# EasyEDA Pro project ProPrj_两相交错电源demo_2025-05-26.epro, board PCB10
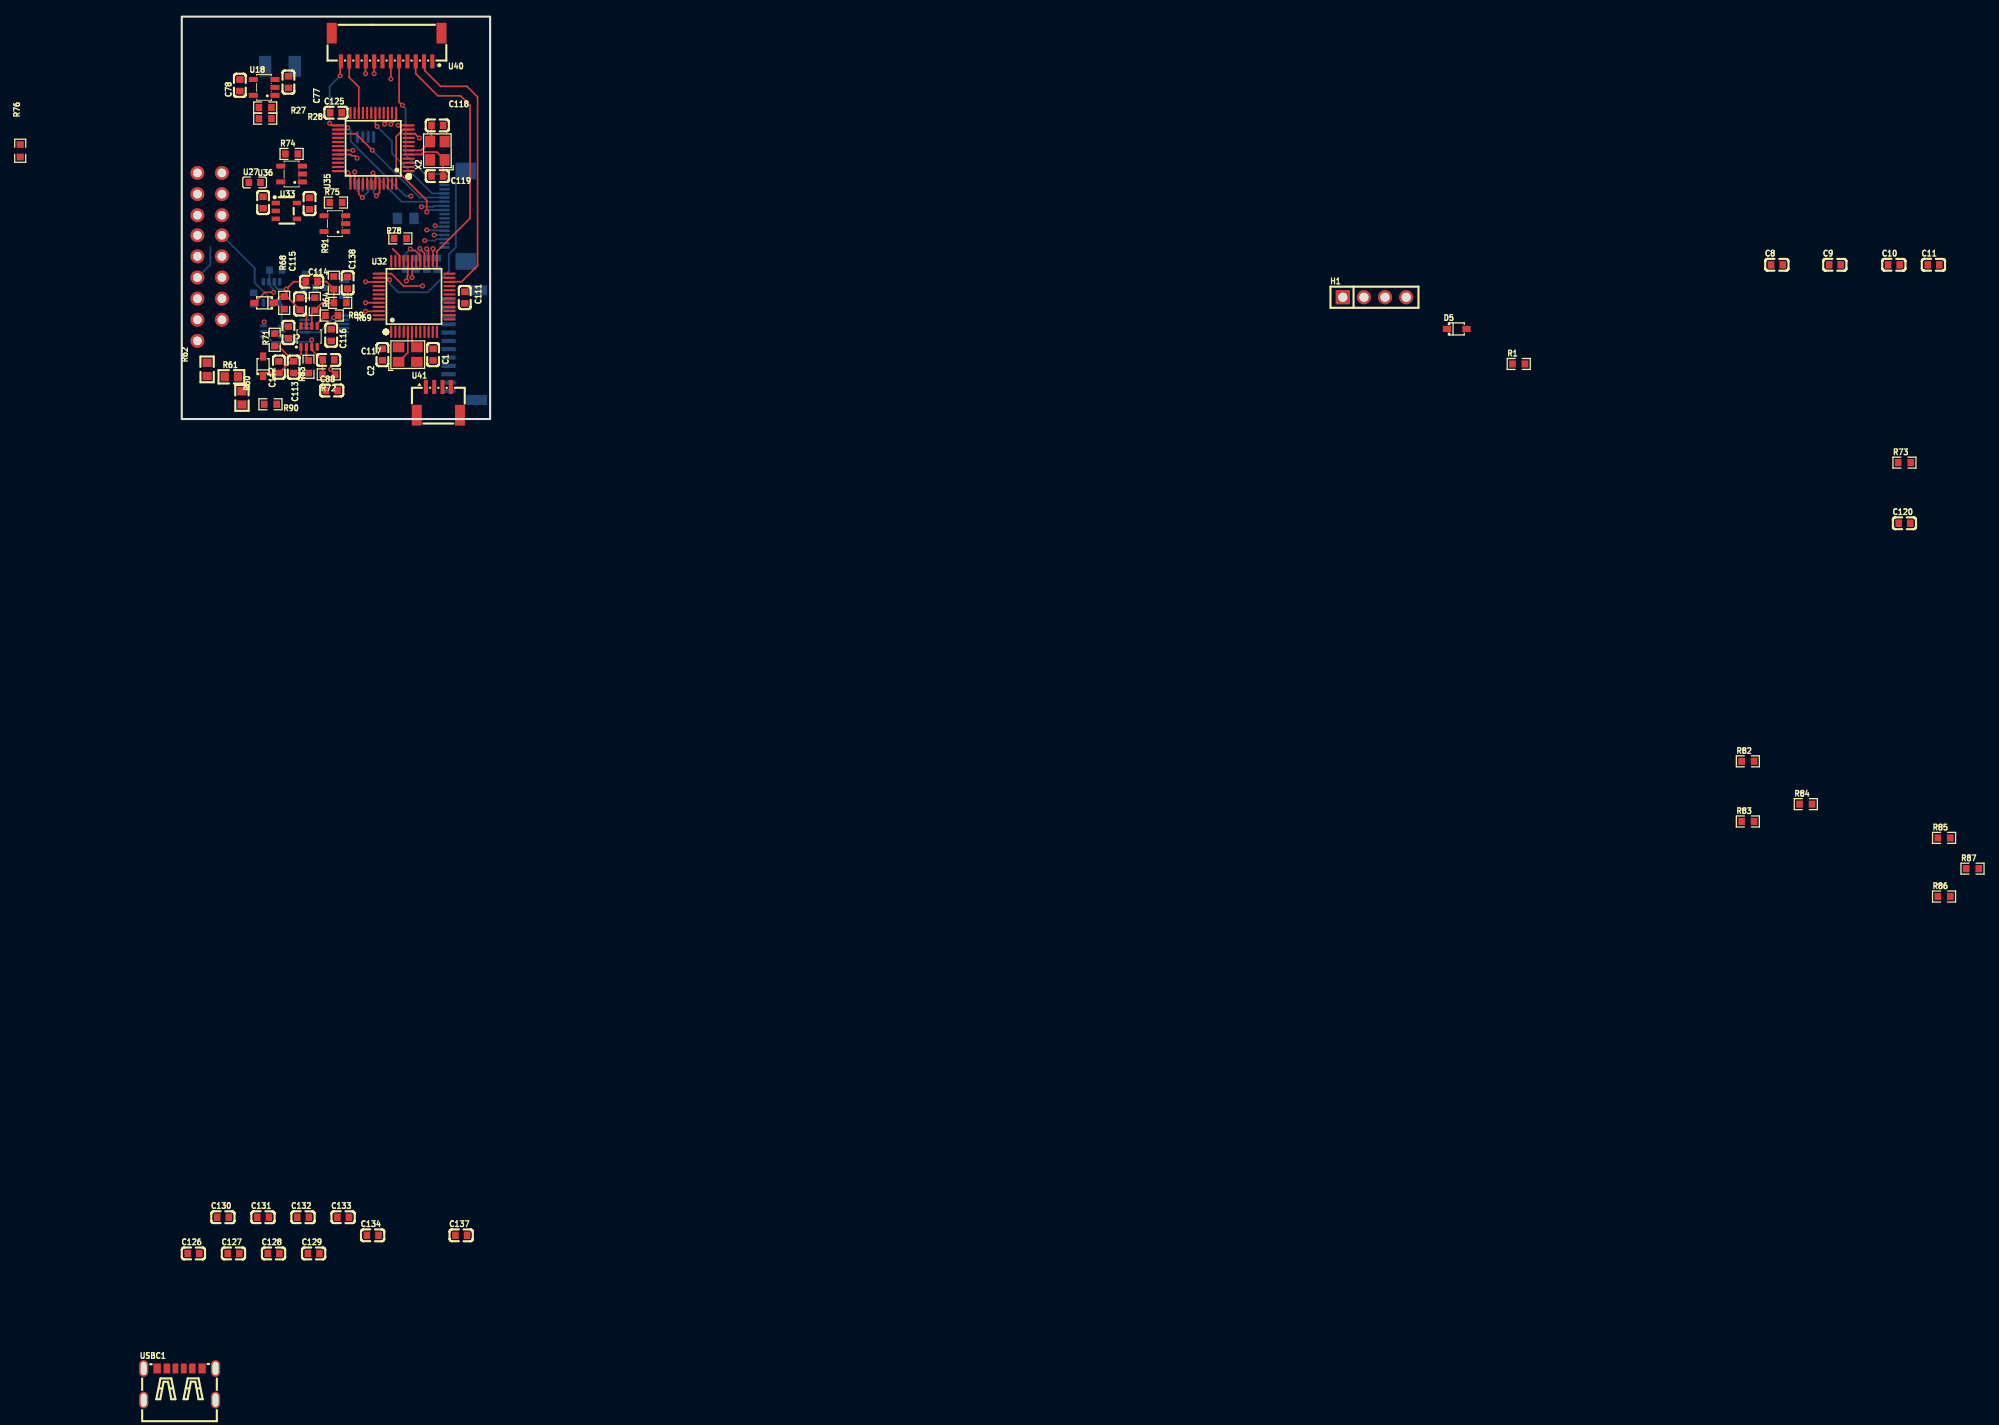
[diagram p13: board, top side]
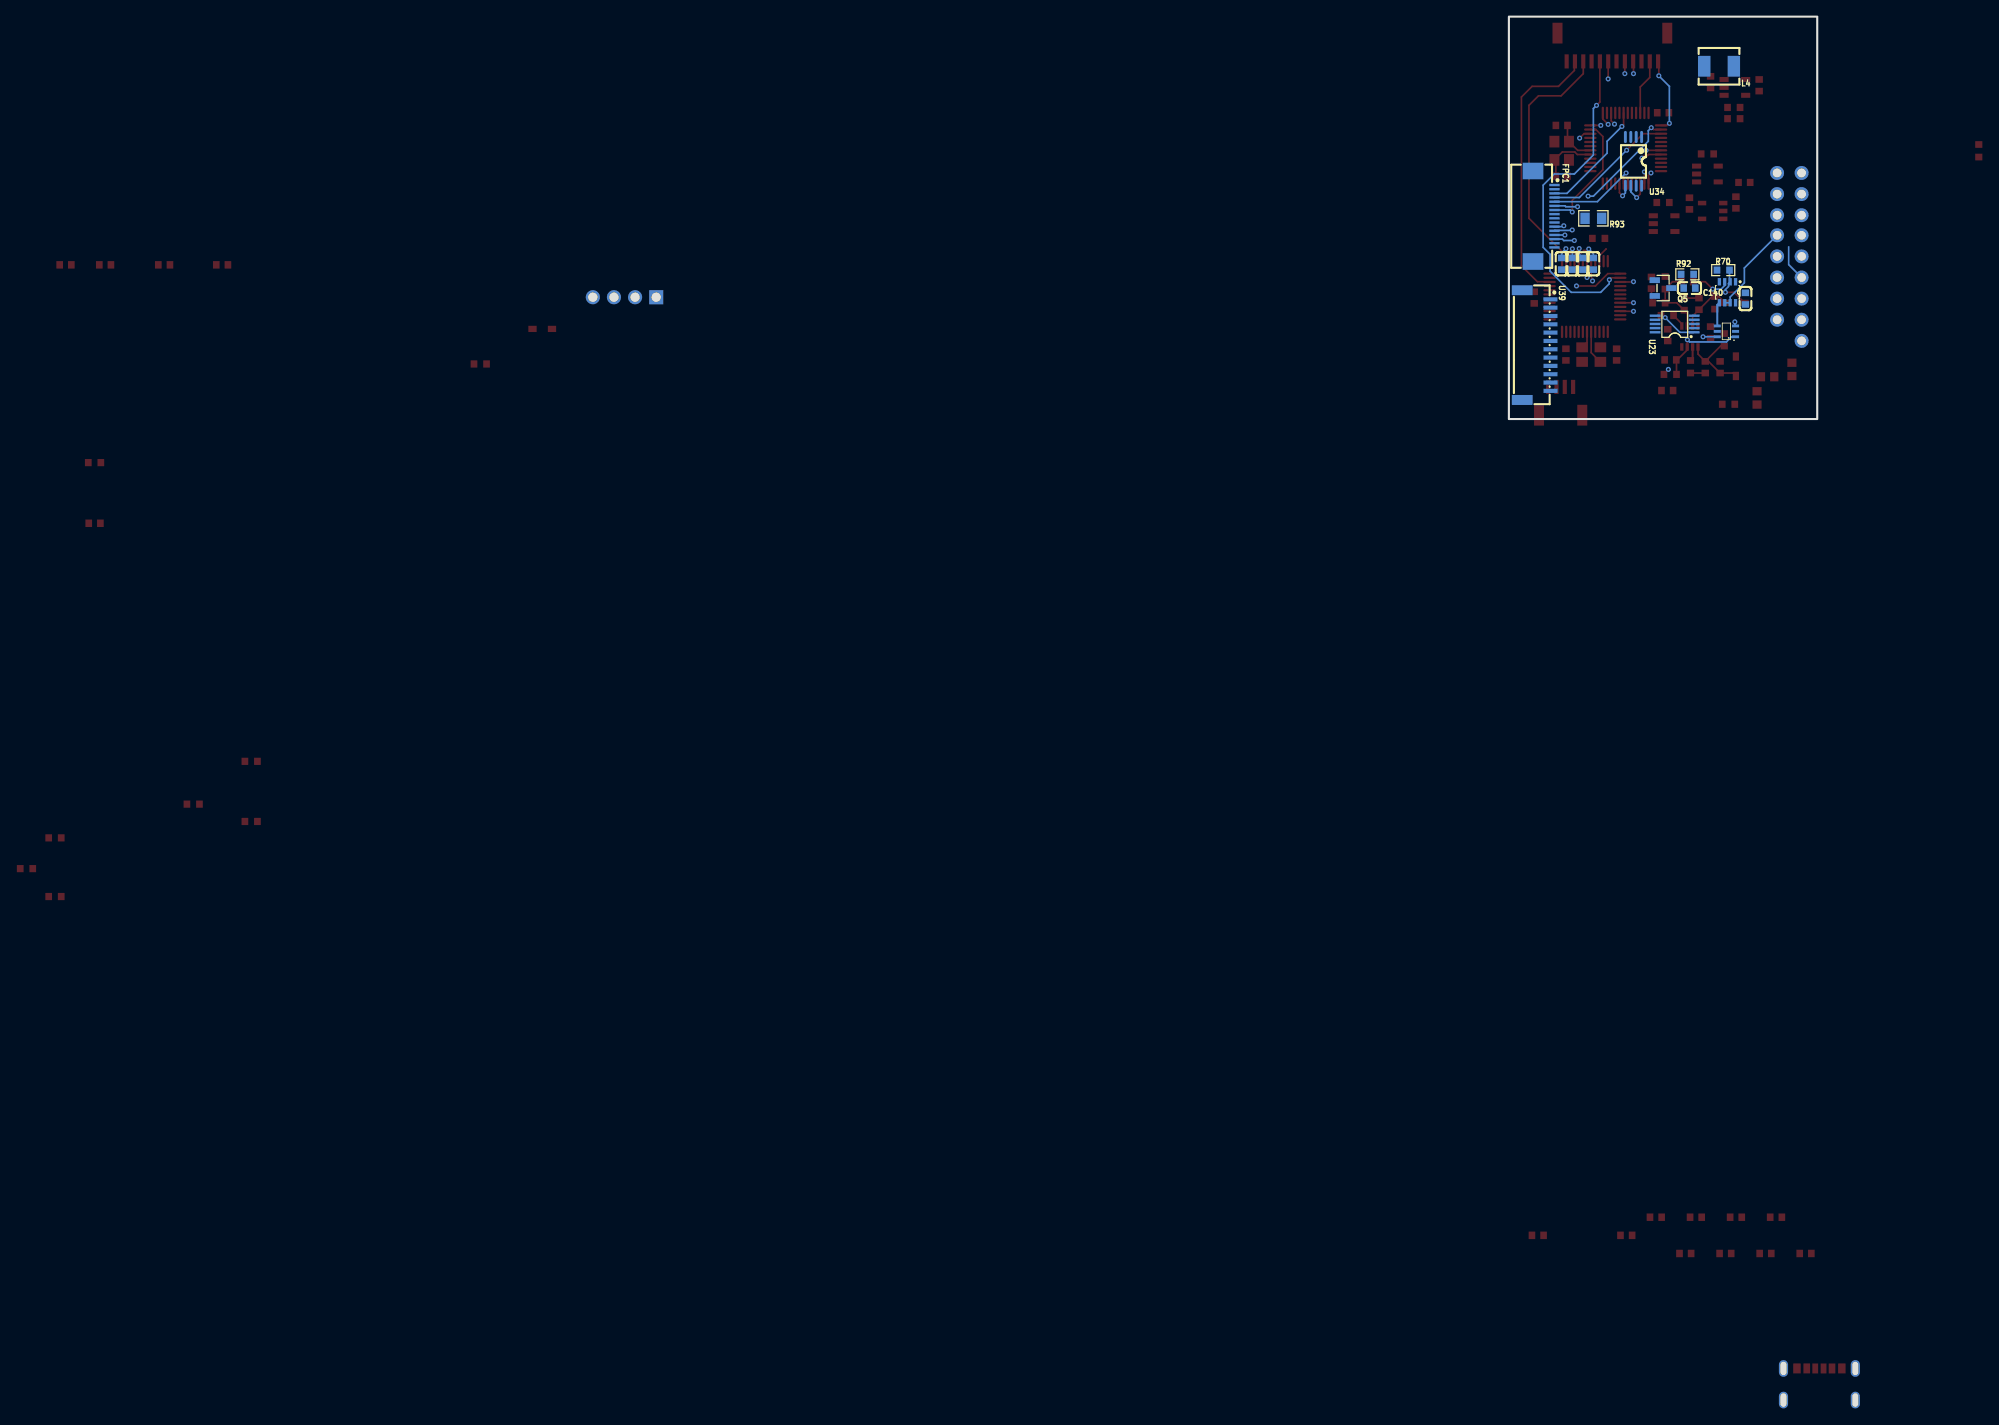
[diagram p14: board, bottom side, seen from below]

Outline 37.08 x 48.39 mm; copper layers: Top Layer, Inner1, Inner2, Bottom Layer. Coordinates in mm from the lower left corner of the outline.
Outline path: rectangle 0,48.39 37.08,0
Stack: Top Layer 0.035mm 外层铜厚1oz / Dielectric1 0.2104mm 7628 RC49% 8.6mil / Inner1 0.0152mm 内层铜厚 / Dielectric2 1.065mm 1.1mm H/HOZ Copper / Inner2 0.0152mm 内层铜厚 / Dielectric3 0.2104mm 7628 RC49% 8.6mil / Bottom Layer 0.035mm 外层铜厚1oz

## Design rules (mm)
template: 自定义配置
spacing copperThickness1oz (default): track to track 0.102, other pairs 0.152 to 0.3
spacing copperThickness2oz: track to track 0.203, other pairs 0.152 to 0.3
track width copperThickness1oz (default): min 0.127, default 0.254, max 2.54
track width copperThickness2oz: min 0.203, default 0.254, max 2.54
differential pair differentialPair (default): width min 0.127, default 0.254, max 2.54; gap min 0.152, default 0.152
via viaSize (default): diameter min 0.5, default 0.61, max 10; hole min 0.3, default 0.305, max 6.3

## Placement (name value [footprint] x y rotation side)
C1  22pF  [C0603#2]  30.23 7.75 90 top
C2  22pF  [C0603#2]  24.13 7.75 90 top
C8  1uF  [C0603#2]  191.85 18.54 0 top
C9  1uF  [C0603#2]  198.82 18.54 0 top
C10  1uF  [C0603#2]  205.92 18.54 0 top
C11  1uF  [C0603#2]  210.69 18.54 0 top
C77  10uF  [C0603#2]  12.83 40.51 90 top
C78  10uF  [C0603#2]  6.99 40.13 90 top
C88  1uF  [C0603#2]  18.03 3.43 0 top
C109  10uF  [C0603#2]  9.78 26.03 270 top
C110  10uF  [C0603#2]  15.37 25.91 90 top
C111  150n  [C0603#2]  34.04 14.61 90 top
C112  100nF  [C0603#2]  11.68 6.23 270 top
C113  100nF  [C0603#2]  13.46 6.23 90 top
C114  100nF  [C0603#2]  15.62 16.51 180 top
C115  100nF  [C0603#2]  14.22 13.84 270 top
C116  105/25V  [C0603]  17.98 10.09 90 top
C117  105/25V  [C0603]  17.65 7.11 180 top
C118  22pF  [C0603#2]  30.73 35.31 180 top
C119  22pF  [C0603#2]  30.73 29.21 180 top
C120  100nF  [C0603#2]  207.19 -12.53 0 top
C121  105/25V  [C0603]  28.19 18.67 90 bottom
C122  105/25V  [C0603]  26.92 18.67 90 bottom
C123  105/25V  [C0603]  29.46 18.67 90 bottom
C124  105/25V  [C0603]  30.73 18.67 90 bottom
C125  10uF  [C0603#2]  18.54 36.83 0 top
C126  1uF  [C0603#2]  1.41 -100.34 0 top
C127  1uF  [C0603#2]  6.22 -100.34 0 top
C128  1uF  [C0603#2]  11.04 -100.34 0 top
C129  1uF  [C0603#2]  15.86 -100.34 0 top
C130  1uF  [C0603#2]  4.96 -95.98 0 top
C131  1uF  [C0603#2]  9.77 -95.98 0 top
C132  1uF  [C0603#2]  14.59 -95.98 0 top
C133  1uF  [C0603#2]  19.41 -95.98 0 top
C134  1uF  [C0603#2]  22.96 -98.16 0 top
C135  1uF  [C0603#2]  8.64 14.48 270 bottom
C136  1uF  [C0603#2]  12.83 10.41 90 top
C137  1uF  [C0603#2]  33.61 -98.16 0 top
C138  105/25V  [C0603]  19.94 16.38 270 top
C140  10uF  [C0603#2]  15.37 15.75 0 bottom
D5  1N5819WS  [SOD-323_L1.8-W1.3-LS2.5-RD]  153.35 10.84 0 top
D10  1N4148WS  [SOD-323_L1.8-W1.3-LS2.5-RD]  9.78 6.35 90 top
D11  1N4148WS  [SOD-323_L1.8-W1.3-LS2.5-RD]  9.91 13.97 180 top
FPC1  FPC-05F-16PH20  [FPC-SMD_16P-P0.50_FPC-05F-16PH20]  32.89 24.38 270 bottom
H1  Header-Male-2.54_1x4  [HDR-TH_4P-P2.54-V-M]  143.45 14.65 0 top
L4  2.2uH  [IND-SMD_L4.9-W4.4_MAPM0420F]  11.81 42.42 0 bottom
NOREF  -  [Pad_e86]  4.83 29.59 180 top
NOREF#2  -  [Pad_e78]  1.88 19.56 180 top
NOREF#3  -  [Pad_e80]  4.83 22.1 180 top
NOREF#4  -  [Pad_e76]  4.83 17.02 180 top
NOREF#5  -  [Pad_e71]  4.83 11.94 180 top
NOREF#6  -  [Pad_e72]  1.88 11.94 180 top
NOREF#7  -  [Pad_e75]  1.88 17.02 180 top
NOREF#8  -  [Pad_e70]  1.88 9.4 180 top
NOREF#9  -  [Pad_e79]  1.88 22.1 180 top
NOREF#10  -  [Pad_e77]  4.83 19.56 180 top
NOREF#11  -  [Pad_e83]  1.88 27.05 180 top
NOREF#12  -  [Pad_e82]  1.88 24.51 180 top
NOREF#13  -  [Pad_e85]  1.88 29.59 180 top
NOREF#14  -  [Pad_e84]  4.83 27.05 180 top
NOREF#15  -  [Pad_e81]  4.83 24.51 180 top
NOREF#16  -  [Pad_e74]  4.83 14.48 180 top
NOREF#17  -  [Pad_e73]  1.88 14.48 180 top
Q5  SS8050  [SOT-23-3_L2.9-W1.3-P1.90-LS2.4-BR]  18.54 15.75 0 bottom
R1  33k  [R0603]  160.8 6.62 0 top
R27  442kΩ  [R0603]  10.03 36.12 0 top
R28  100kΩ  [R0603]  10.03 37.47 180 top
R60  2K/0.1%  [R0603#2]  7.24 2.54 90 top
R61  20K/0.1%  [R0603#2]  5.97 5.08 180 top
R62  20K/0.1%  [R0603#2]  3.05 5.97 90 top
R63  39kΩ  [R0603]  15.24 6.29 270 top
R64  39kΩ  [R0603]  16 13.84 90 top
R68  100k  [R0603]  12.32 13.97 270 top
R69  5.1k  [R0603]  18.03 12.45 0 top
R70  33k  [R0603]  11.3 17.91 0 bottom
R71  100k  [R0603]  11.18 9.53 270 top
R72  5.1k  [R0603]  17.68 5.37 0 top
R73  33k  [R0603]  207.19 -5.24 0 top
R74  0.2Ω  [R0603]  13.21 31.88 0 top
R75  0.1Ω  [R0603]  18.54 26.03 0 top
R76  5.1k  [R0603]  -19.43 32.26 270 top
R78  5.1k  [R0603]  26.29 21.72 180 top
R82  24k  [R0603]  188.36 -41.16 0 top
R83  75k  [R0603]  188.36 -48.39 0 top
R84  5.1k  [R0603]  195.33 -46.31 0 top
R85  24k  [R0603]  211.96 -50.37 0 top
R86  75k  [R0603]  211.96 -57.42 0 top
R87  5.1k  [R0603]  215.38 -54.06 0 top
R89  30k  [R0603]  19.05 13.97 0 top
R90  5.1k  [R0603]  10.67 1.78 180 top
R91  0  [R0603]  18.29 16.38 270 top
R92  2.2k  [R0603]  15.62 17.4 180 bottom
R93  20Ω  [R0805]  26.92 24.13 0 bottom
U18  TLV62569DBVR  [SOT-23-5_L3.0-W1.7-P0.95-LS2.8-BR]  9.91 39.88 0 top
U23  DAC8562SDGSR  [VSSOP-10_L3.0-W3.0-P0.50-LS4.9-BL]  17.15 11.43 90 bottom
U27  磁珠60Ω±25%@100MHz/3A/0603  [L0603]  8.76 28.45 0 top
U28  -  [SOT-23-5_L3.0-W1.7-P0.95-LS2.8-TL]  12.57 25.02 0 top
U31  SGM3157-MS  [SC-70-6_L2.0-W1.3-P0.65-LS2.1-BL]  10.92 10.54 90 bottom
U32  STM32G473CBT6  [LQFP-48_L7.0-W7.0-P0.50-LS9.0-BL]  27.94 14.73 0 top
U33  INA180A3IDBVR  [SOT-23-5_L3.0-W1.7-P0.95-LS2.8-BR]  18.42 23.5 0 top
U34  M24C64-DRDW3TP/K  [TSSOP-8_L4.4-W3.0-P0.65-LS6.4-BL]  22.1 30.99 0 bottom
U35  STM32G473CBT6  [LQFP-48_L7.0-W7.0-P0.50-LS9.0-BL]  23.04 32.56 90 top
U36  INA180A3IDBVR  [SOT-23-5_L3.0-W1.7-P0.95-LS2.8-BR]  13.21 29.46 0 top
U37  TLV9062IDDFR  [TSOT-23-8_L2.9-W1.6-P0.65-LS2.8-BL]  15.31 9.93 0 top
U38  TLV9062IDDFR  [TSOT-23-8_L2.9-W1.6-P0.65-LS2.8-BL]  10.8 15.24 0 bottom
U39  ZX-SH1.0-12PWT  [CONN-SMD_ZX-SH1.0-12PWT]  33.78 8.89 270 bottom
U40  ZX-SH1.0-12PWT  [CONN-SMD_ZX-SH1.0-12PWT]  24.64 44.7 180 top
U41  ZX-SH1.0-4PWT  [CONN-SMD_4P-P1.00_MEGASTAR_ZX-SH1.0-4PWT]  30.86 2.16 0 top
USBC1  USB 3.1 C 6PF  [USB-C-SMD_TYPE-C-USB-13]  -0.26 -116.06 0 top
X1  8MHz  [OSC-SMD_4P-L3.2-W2.5-BL]  27.18 7.75 0 top
X2  8MHz  [OSC-SMD_4P-L3.2-W2.5-BL]  30.73 32.26 90 top

## Footprints (pads in the part's own frame, mm; a bottom-side part is the same pattern mirrored in y, then rotated)
C0603
  custom 0.8x0.9 smd: 1(-0.7,0) 2(0.7,0)
C0603#2
  rect 0.8x0.9 smd: 1(-0.7,0) 2(0.7,0)
CONN-SMD_4P-P1.00_MEGASTAR_ZX-SH1.0-4PWT
  rect 0.5x1.7 smd: 1(-1.5,1.7) 2(-0.5,1.7) 3(0.5,1.7) 4(1.5,1.7)
  rect 1.2x2.5 smd: 5(2.6,-1.7) 6(-2.6,-1.7)
CONN-SMD_ZX-SH1.0-12PWT
  rect 0.5x1.7 smd: 1(-5.5,1.7) 2(-4.5,1.7) 3(-3.5,1.7) 4(-2.5,1.7) 5(-1.5,1.7) 6(-0.5,1.7) 7(0.5,1.7) 8(1.5,1.7) 9(2.5,1.7) 10(3.5,1.7) 11(4.5,1.7) 12(5.5,1.7)
  rect 1.2x2.5 smd: 13(6.6,-1.7) 14(-6.6,-1.7)
FPC-SMD_16P-P0.50_FPC-05F-16PH20
  rect 0.3x1.25 smd: 1(-3.75,1.288) 2(-3.25,1.288) 3(-2.75,1.288) 4(-2.25,1.288) 5(-1.75,1.288) 6(-1.25,1.288) 7(-0.75,1.288) 8(-0.25,1.288) 9(0.25,1.288) 10(0.75,1.288) 11(1.25,1.288) 12(1.75,1.288) 13(2.25,1.288) 14(2.75,1.288) 15(3.25,1.288) 16(3.75,1.288)
  rect 2x2.5 smd: 17(5.44,-1.288) 18(-5.44,-1.288)
HDR-TH_4P-P2.54-V-M
  rect 1.7x1.7 hole 1.1: 1(-3.81,0)
  round 1.7 hole 1.1: 2(-1.27,0) 3(1.27,0) 4(3.81,0)
IND-SMD_L4.9-W4.4_MAPM0420F
  rect 1.5x2.5 smd: 1(-1.78,0) 2(1.78,0)
L0603
  rect 0.8x0.864 smd: 1(-0.7,0) 2(0.7,0)
LQFP-48_L7.0-W7.0-P0.50-LS9.0-BL
  oval 0.27x1.5 smd: 1(-2.75,-4.25) 2(-2.25,-4.25) 3(-1.75,-4.25) 4(-1.25,-4.25) 5(-0.75,-4.25) 6(-0.25,-4.25) 7(0.25,-4.25) 8(0.75,-4.25) 9(1.25,-4.25) 10(1.75,-4.25) 11(2.25,-4.25) 12(2.75,-4.25) 25(2.75,4.25) 26(2.25,4.25) 27(1.75,4.25) 28(1.25,4.25) 29(0.75,4.25) 30(0.25,4.25) 31(-0.25,4.25) 32(-0.75,4.25) 33(-1.25,4.25) 34(-1.75,4.25) 35(-2.25,4.25) 36(-2.75,4.25)
  oval 1.5x0.27 smd: 13(4.25,-2.75) 14(4.25,-2.25) 15(4.25,-1.75) 16(4.25,-1.25) 17(4.25,-0.75) 18(4.25,-0.25) 19(4.25,0.25) 20(4.25,0.75) 21(4.25,1.25) 22(4.25,1.75) 23(4.25,2.25) 24(4.25,2.75) 37(-4.25,2.75) 38(-4.25,2.25) 39(-4.25,1.75) 40(-4.25,1.25) 41(-4.25,0.75) 42(-4.25,0.25) 43(-4.25,-0.25) 44(-4.25,-0.75) 45(-4.25,-1.25) 46(-4.25,-1.75) 47(-4.25,-2.25) 48(-4.25,-2.75)
OSC-SMD_4P-L3.2-W2.5-BL
  rect 1.4x1.2 smd: 1(-1.1,-0.875) 2(1.1,-0.875) 3(1.1,0.875) 4(-1.1,0.875)
Pad_e70
  round 1.677 hole 1.042: 1(0,0)
Pad_e71
  round 1.677 hole 1.042: 1(0,0)
Pad_e72
  round 1.677 hole 1.042: 1(0,0)
Pad_e73
  round 1.677 hole 1.042: 1(0,0)
Pad_e74
  round 1.677 hole 1.042: IIN(0,0)
Pad_e75
  round 1.677 hole 1.042: 1(0,0)
Pad_e76
  round 1.677 hole 1.042: 1(0,0)
Pad_e77
  round 1.677 hole 1.042: 1(0,0)
Pad_e78
  round 1.677 hole 1.042: 1(0,0)
Pad_e79
  round 1.677 hole 1.042: 1(0,0)
Pad_e80
  round 1.677 hole 1.042: 1(0,0)
Pad_e81
  round 1.677 hole 1.042: 1(0,0)
Pad_e82
  round 1.677 hole 1.042: 1(0,0)
Pad_e83
  round 1.677 hole 1.042: 1(0,0)
Pad_e84
  round 1.677 hole 1.042: 1(0,0)
Pad_e85
  round 1.677 hole 1.042: 1(0,0)
Pad_e86
  round 1.677 hole 1.042: 1(0,0)
R0603
  rect 0.806x0.864 smd: 1(-0.753,0) 2(0.753,0)
R0603#2
  rect 1x1.1 smd: 1(-0.8,0) 2(0.8,0)
R0805
  rect 1.133x1.377 smd: 1(-1,0) 2(1,0)
SC-70-6_L2.0-W1.3-P0.65-LS2.1-BL
  rect 0.35x0.85 smd: 1(-0.65,-1.1) 2(0,-1.1) 3(0.65,-1.1) 4(0.65,1.1) 5(0,1.1) 6(-0.65,1.1)
SOD-323_L1.8-W1.3-LS2.5-RD
  rect 1x0.75 smd: 1(-1.173,0) 2(1.173,0)
SOT-23-3_L2.9-W1.3-P1.90-LS2.4-BR
  rect 1.25x0.7 smd: 1(1,-0.95) 2(1,0.95) 3(-1,0)
SOT-23-5_L3.0-W1.7-P0.95-LS2.8-BR
  rect 1.1x0.6 smd: 1(1.3,-0.95) 2(1.3,0) 3(1.3,0.95) 4(-1.3,0.95) 5(-1.3,-0.95)
SOT-23-5_L3.0-W1.7-P0.95-LS2.8-TL
  rect 1.001x0.551 smd: 1(-1.272,0.95) 2(-1.272,0) 3(-1.272,-0.95) 4(1.272,-0.95) 5(1.272,0.95)
TSOT-23-8_L2.9-W1.6-P0.65-LS2.8-BL
  rect 0.4x0.9 smd: 1(-0.975,-1.26) 2(-0.325,-1.26) 3(0.325,-1.26) 4(0.975,-1.26) 5(0.975,1.26) 6(0.325,1.26) 7(-0.325,1.26) 8(-0.975,1.26)
TSSOP-8_L4.4-W3.0-P0.65-LS6.4-BL
  oval 0.353x1.454 smd: 1(-0.975,-2.927) 2(-0.325,-2.927) 3(0.325,-2.927) 4(0.975,-2.927) 5(0.975,2.927) 6(0.325,2.927) 7(-0.325,2.927) 8(-0.975,2.927)
USB-C-SMD_TYPE-C-USB-13
  oval 1.1x2 hole 0.7x1.6: 1(-4.32,1.899) 2(-4.32,-1.901) 3(4.32,-1.901) 4(4.32,1.899)
  rect 0.7x1.2 smd: A5(-0.5,1.897) B5(0.5,1.897)
  rect 0.8x1.2 smd: A9(-1.52,1.899) B9(1.52,1.901)
  rect 0.9x1.2 smd: A12(-2.7,1.899) B12(2.7,1.899)
VSSOP-10_L3.0-W3.0-P0.50-LS4.9-BL
  rect 0.3x1.3 smd: 1(-1,-2.35) 2(-0.5,-2.35) 3(0,-2.35) 4(0.5,-2.35) 5(1,-2.35) 6(1,2.35) 7(0.5,2.35) 8(0,2.35) 9(-0.5,2.35) 10(-1,2.35)

## Nets
As in the schematic, except:
5VIN: NOREF.1 R74.2 U36.3
12V: NOREF#14.1 R75.2 U33.3
GND: C1.1 C2.2 C8.1 C9.1 C10.1 C11.1 C77.1 C78.1 C88.1 C109.2 C110.1 C111.1 C116.1 C117.1 C118.1 C119.2 C120.1 C121.1 C122.1 C123.1 C124.1 C125.1 C126.1 C127.1 C128.1 C129.1 C130.1 C131.1 C132.1 C133.1 C134.1 C135.1 C136.1 C137.1 C140.1 FPC1.1 FPC1.16 FPC1.17 FPC1.18 H1.4 NOREF#4.1 NOREF#13.1 R1.1 R28.1 R60.1 R83.2 R86.2 U18.2 U23.3 U28.2 U31.2 U32.19 U32.23 U32.35 U32.45 U32.47 U33.2 U34.1 U34.2 U34.3 U34.4 U34.7 U35.19 U35.23 U35.35 U35.45 U35.47 U36.2 U37.4 U38.4 U39.1 U39.13 U39.14 U40.1 U40.4 U40.7 U40.10 U40.13 U40.14 U41.5 U41.6 X1.2 X1.4 X2.2 X2.4
DEMB: NOREF#9.1 U32.41
EN: NOREF#7.1 U32.34
FB: NOREF#3.1 U38.6 U38.7
PG1: NOREF#15.1 U32.9
PG2: NOREF#11.1 U32.10
SCLA: NOREF#10.1 U32.39
SDAA: NOREF#2.1 U32.44
VOUT: NOREF#5.1 R62.2

Pads without a net: FPC1 8; U28 4; U32 3 4 16 17 18 40 43; U41 1 2 3 4; USBC1 1 2 3 4 A5 A9 A12 B5 B9 B12

## Via types
v1: diameter 0.61, hole 0.305, Top Layer to Bottom Layer, 45 vias

## Routing (per net, layer and track width the routed paths; a pad name or vN(x,y) marks a point on that pad's centre or on a via; arc(x,y) is an arc through that point)
ADC1: length 3.1
  Top Layer w0.203: U32.28 29.19,19.94 v1(28.63,20.5)
  Bottom Layer w0.203: C121.2 28.63,19.8 v1(28.63,20.5)
ADC2: length 3.5
  Top Layer w0.203: U32.29 28.69,19.65 28.07,20.27 27.66,20.27 v1(27.48,20.45)
  Bottom Layer w0.203: C122.2 26.92,19.89 v1(27.48,20.45)
ADC3: length 2.7
  Top Layer w0.203: v1(29.45,20.47) 29.69,20.23 U32.27
  Bottom Layer w0.203: C123.2 29.45,19.38 v1(29.45,20.47)
ADC4: length 2.8
  Top Layer w0.203: v1(30.22,20.48) 30.22,19.68 30.19,19.65 U32.26
  Bottom Layer w0.203: C124.2 30.73,19.97 v1(30.22,20.48)
CLK: length 40.1
  Top Layer w0.203: v1(25,16.75) 24.77,16.98 U32.38 ; v1(26.54,37.72) 26.14,38.12 U40.5
  Bottom Layer w0.203: 25.02,16.51 25.02,16.26 26.03,15.24 29.59,15.24 32.13,17.78 32.13,19.81 32.97,20.65 32.97,28.12 31.62,29.46 29.21,29.46 26.92,31.75 26.92,37.34 v1(26.54,37.72)
CLK1: length 16.5
  Top Layer w0.203: U35.38 v1(20.79,29.72) ; U40.8 v1(23.14,41.53)
  Inner2 w0.203: v1(20.79,29.72) 20.79,30.01 19.81,30.99 19.81,32.39 23.14,35.71 v1(23.14,41.53)
CS: length 18.3
  Top Layer w0.203: U35.12 v1(26.03,35.31)
  Inner2 w0.203: v1(29.46,22.73) 27.94,22.73 26.67,24 26.67,34.67 v1(26.03,35.31)
  Bottom Layer w0.203: v1(29.46,22.73) 29.51,22.68 31.56,22.68 FPC1.12
DC: length 14.7
  Top Layer w0.203: v1(29.46,24.89) 29.46,26.29 25.78,29.97 25.78,33.97 26.62,34.81 U35.11
  Bottom Layer w0.203: FPC1.7 29.71,25.13 v1(29.46,24.89)
DIO: length 38.3
  Top Layer w0.203: v1(28.96,16) 26.67,16 25.19,17.48 U32.37 ; v1(25.15,40.89) 25.15,43 U40.6
  Inner2 w0.203: v1(25.15,40.89) 25.15,40.13 33.53,31.75 33.53,20.57 v1(28.96,16)
DIO1: length 16.5
  Top Layer w0.203: U35.37 20.29,29.3 v1(19.99,29.59) ; v1(22.1,41.53) 22.1,42.96 U40.9
  Inner2 w0.203: v1(19.99,29.59) 19.05,30.54 19.05,33.27 22.1,36.32 v1(22.1,41.53)
EN: length 6.1
  Top Layer w0.203: U32.34 26.19,19.65 25.4,20.44 25.4,20.45
  Bottom Layer w0.203: 3.43,20.7 3.43,18.57 NOREF#7.1
FB: length 11.1
  Bottom Layer w0.203: U38.6 U38.7 10.47,14.68 8.76,16.38 8.76,18.16 NOREF#3.1
INT: length 11.5
  Top Layer w0.203: U35.43 23.29,29.29 v1(22.99,29.59)
  Bottom Layer w0.203: FPC1.5 26.44,26.13 v1(22.99,29.59)
IOUTSA: length 1.8
  Top Layer w0.203: R89.2 19.94,14.11 19.94,15.68
ISET: length 5.1
  Top Layer w0.203: v1(18.29,12.19) 18.87,12.19 19.05,12.37
  Bottom Layer w0.203: U23.1 16.53,10.43 v1(18.29,12.19)
MOSI: length 21.8
  Top Layer w0.203: v1(24.38,35.46) 24.79,35.86 U35.15
  Inner2 w0.203: v1(29.21,21.46) 26.16,21.46 25.02,22.61 25.02,33.02 24.38,33.66 v1(24.38,35.46)
  Bottom Layer w0.203: v1(29.21,21.46) 30.48,21.46 30.65,21.63 FPC1.14
PB9: length 12.9
  Top Layer w0.203: v1(22.1,12.95) 23.66,12.95 U32.46
  Inner2 w0.203: v1(22.1,12.95) 20.19,11.05 15.75,11.05 14.59,9.89 v1(13.73,9.89)
  Bottom Layer w0.203: 12.02,9.89 13.72,9.89
RST_PM: length 14
  Top Layer w0.203: U35.10 28.05,34.31 v1(28.58,33.78)
  Inner2 w0.203: v1(28.58,33.78) 28.58,27.94 30.48,26.03 v1(30.48,23.24)
  Bottom Layer w0.203: v1(30.48,23.24) 30.59,23.13 FPC1.11
RSTC: length 17.6
  Top Layer w0.203: U35.26 19.7,34.81 19.94,35.05
  Inner2 w0.203: v1(27.56,26.8) v1(28.83,25.53)
  Bottom Layer w0.203: v1(28.83,25.53) 30.23,25.53 30.33,25.63 FPC1.6 ; v1(27.56,26.8) 26.92,26.8 20.32,33.4 20.32,34.67 v1(19.96,35.03)
RX: length 22.6
  Top Layer w0.203: U35.31 v1(20.58,32.31) ; 27.05,16.64 27.13,16.71 27.13,17.25 27.19,17.31 U32.32
  Inner2 w0.203: v1(20.58,32.31) 20.61,32.29 20.61,32 20.55,31.94 20.55,31.62 20.52,31.6 20.52,31.14 22.28,29.39 22.28,21.35 v1(27.02,16.61)
RXT: length 30
  Top Layer w0.203: U32.25 30.69,20.16 34.67,24.14 34.67,37.72 33.53,38.86 30.81,38.86 28.14,41.53 U40.3
RXT1: length 9.1
  Top Layer w0.203: U40.12 19.05,42.92 v1(19.05,41.28) ; U35.25 18.03,35.31 v1(17.78,35.56)
  Bottom Layer w0.203: v1(17.78,35.56) 17.78,40 v1(19.05,41.28)
SCK: length 20.2
  Top Layer w0.203: v1(25.15,35.43) 25.79,36.07 U35.13
  Inner2 w0.203: v1(25.15,35.43) 25.4,35.18 25.4,34.8 25.91,34.29 25.91,23.5 27.31,22.1 30.33,22.1 v1(30.35,22.12)
  Bottom Layer w0.203: FPC1.13 30.35,22.13
SCK_CM: length 14
  Top Layer w0.203: U35.18 23.29,35.39 v1(23.5,35.18)
  Bottom Layer w0.203: v1(23.5,35.18) 25.27,33.4 25.27,31.96 30.1,27.13 FPC1.3
SCLA: length 21.1
  Top Layer w0.203: v1(22.1,16.51) 22.13,16.48 U32.39
  Inner2 w0.203: NOREF#10.1 5.97,20.7 17.91,20.7 v1(22.1,16.51)
SDA_CM: length 16
  Top Layer w0.203: U35.27 20.94,34.31 v1(22.92,32.32)
  Bottom Layer w0.203: FPC1.4 28.61,26.63 v1(22.92,32.32)
SDAA: length 24.8
  Top Layer w0.203: U32.44 v1(22.1,13.98)
  Inner2 w0.203: NOREF#2.1 3.13,18.3 6.11,18.3 6.99,19.18 16.9,19.18 v1(22.1,13.98)
TX: length 22.1
  Top Layer w0.203: U32.31 27.69,18.98 v1(27.69,17.02) ; U35.32 20.29,31.81 20.44,31.67 20.78,31.67 v1(21.08,31.37)
  Inner2 w0.203: v1(21.08,31.37) 21.59,30.86 22.61,30.86 24.13,29.34 24.13,20.57 v1(27.69,17.02)
TXT: length 33.3
  Top Layer w0.203: U40.2 29.21,42.93 29.21,41.91 31.12,40 34.29,40 35.58,38.72 35.58,18.43 33.66,16.51 32.22,16.51 U32.22
TXT1: length 6.7
  Top Layer w0.203: U40.11 20.14,41.08 21.29,39.93 U35.22
VSET: length 0.8
  Top Layer w0.203: 18.43,5.37 18.43,5.44 v1(17.91,5.97)
VSETL: length 11
  Top Layer w0.203: R72.1 16.93,7.09 16.95,7.11 16.83,7.11 15.64,8.31 U37.3 15.64,9.51 v1(15.62,9.53)
  Bottom Layer w0.203: v1(15.62,9.53) 15.37,9.27 10.92,9.27 10.3,9.89 9.82,9.89
XIN: length 4.1
  Top Layer w0.203: U32.5 27.19,7.98 X1.1
XIN1: length 6.9
  Top Layer w0.203: U35.5 28.85,31.81 29.15,32.11 30.66,32.11 X2.1 31.43,30.98 C119.1
XOUT: length 2.1
  Top Layer w0.203: U32.6 27.69,9.21 X1.3
XOUT1: length 5
  Top Layer w0.203: U35.6 28.81,32.31 X2.3 30.03,33.53 C118.2
$1N4020: length 1.7
  Top Layer w0.254: U37.2 14.99,7.29 R63.1
$1N4948: length 9.6
  Top Layer w0.203: C113.2 13.08,6.93 C112.2 10.13,5.53 D10.1 ; C113.2 11.62,8.77 R71.2 ; C113.2 14.34,7.81 U37.1
$1N5813: length 1.8
  Top Layer w0.203: C113.1 15.24,5.53 R63.2
$1N6197: length 12.2
  Top Layer w0.203: C114.2 13.46,16.51 v1(12.57,15.62) ; D11.1 11.83,14.72 R68.1 12.64,14.72 C115.2 14.99,12.38 U37.7
  Top Layer w0.254: R68.1 12.57,14.98 v1(12.57,15.62)
  Bottom Layer w0.203: v1(12.57,15.62) 11.56,15.62 11.12,16.06 U38.3
$1N6211: length 1.8
  Top Layer w0.203: C115.1 15.95,14.54 R64.2
$1N6287: length 1.7
  Top Layer w0.203: R69.1 16.29,11.45 U37.5
$1N6366: length 10.3
  Top Layer w0.203: v1(11.05,15.24) 10,15.24 D11.2
  Inner2 w0.203: v1(11.05,15.24) 11.05,12.83 v1(9.91,11.68)
  Bottom Layer w0.203: v1(11.05,15.24) 11.05,15.56 10.67,15.95 10.67,16.3 U38.2 10.55,16.58 R70.1 ; v1(9.91,11.68) 9.91,11.28 U31.3
$1N8417: length 2.9
  Bottom Layer w0.254: U38.5 12.02,13.73 U31.4
$1N16419: length 3
  Top Layer w0.203: v1(23.41,26.84) 23.79,27.22 U35.44
  Bottom Layer w0.203: U34.5 23.07,27.18 v1(23.41,26.84)
$1N16424: length 3.8
  Top Layer w0.203: v1(21.72,26.62) 21.29,27.05 U35.39
  Bottom Layer w0.203: 22.42,28.31 22.42,27.33 v1(21.72,26.62)
$1N32091: length 8.7
  Top Layer w0.203: U37.6 15.64,12.72 R64.1 16.88,13.97 R89.1 18.29,13.98 R91.2 17.41,16.51 C114.1
